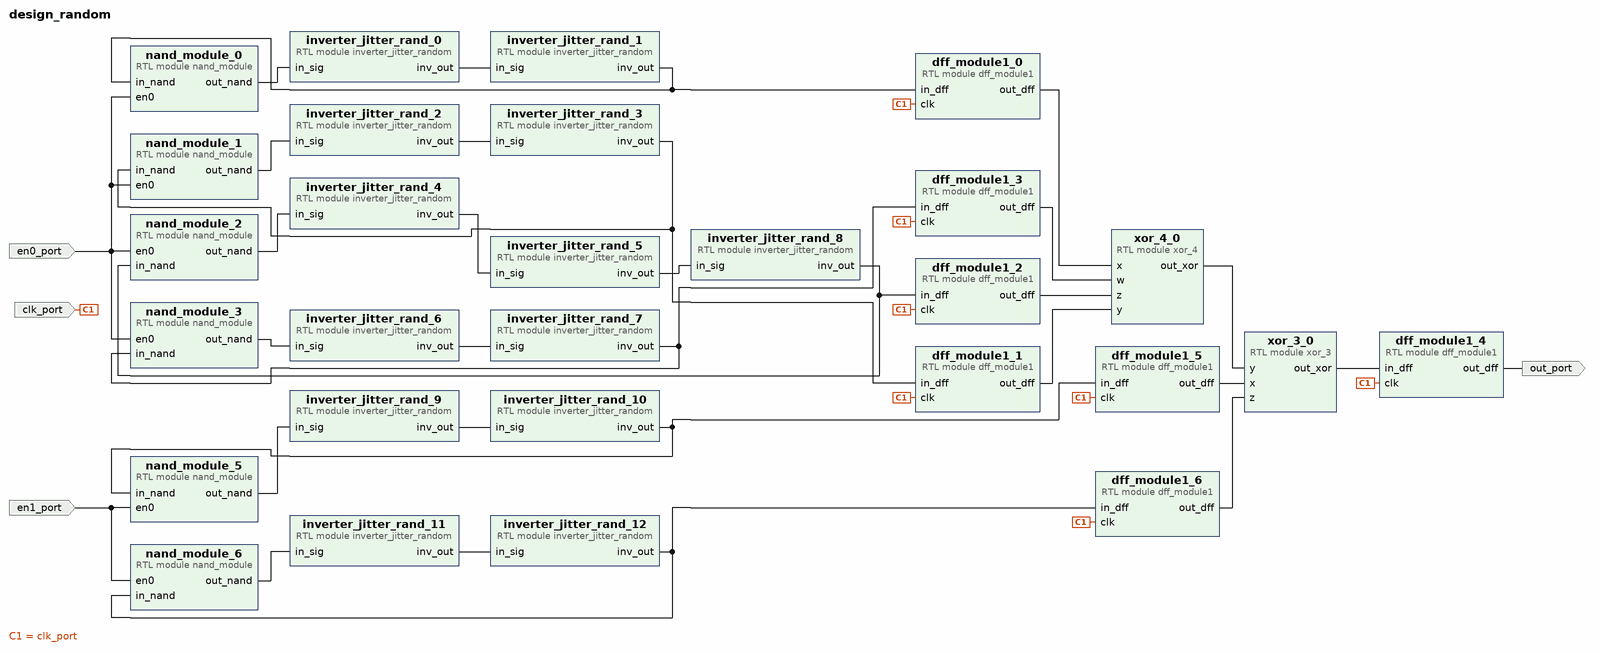
[diagram p0: block diagram of the top level]
# Vivado block design design_random, xc7a100tcsg324-1, Vivado 2024.2
create_bd_design design_random

create_bd_port -dir I en0_port
create_bd_port -dir I clk_port
create_bd_port -dir I en1_port
create_bd_port -dir O out_port

create_bd_cell -type module -reference nand_module nand_module_0
create_bd_cell -type module -reference nand_module nand_module_1
create_bd_cell -type module -reference nand_module nand_module_2
create_bd_cell -type module -reference nand_module nand_module_3
create_bd_cell -type module -reference xor_4 xor_4_0
create_bd_cell -type module -reference nand_module nand_module_5
create_bd_cell -type module -reference nand_module nand_module_6
create_bd_cell -type module -reference xor_3 xor_3_0
create_bd_cell -type module -reference inverter_jitter_random inverter_jitter_rand_0
create_bd_cell -type module -reference inverter_jitter_random inverter_jitter_rand_1
create_bd_cell -type module -reference inverter_jitter_random inverter_jitter_rand_2
create_bd_cell -type module -reference inverter_jitter_random inverter_jitter_rand_3
create_bd_cell -type module -reference inverter_jitter_random inverter_jitter_rand_4
create_bd_cell -type module -reference inverter_jitter_random inverter_jitter_rand_5
create_bd_cell -type module -reference inverter_jitter_random inverter_jitter_rand_6
create_bd_cell -type module -reference inverter_jitter_random inverter_jitter_rand_7
create_bd_cell -type module -reference inverter_jitter_random inverter_jitter_rand_8
create_bd_cell -type module -reference inverter_jitter_random inverter_jitter_rand_9
create_bd_cell -type module -reference inverter_jitter_random inverter_jitter_rand_10
create_bd_cell -type module -reference inverter_jitter_random inverter_jitter_rand_11
create_bd_cell -type module -reference inverter_jitter_random inverter_jitter_rand_12
create_bd_cell -type module -reference dff_module1 dff_module1_0
create_bd_cell -type module -reference dff_module1 dff_module1_1
create_bd_cell -type module -reference dff_module1 dff_module1_2
create_bd_cell -type module -reference dff_module1 dff_module1_3
create_bd_cell -type module -reference dff_module1 dff_module1_4
create_bd_cell -type module -reference dff_module1 dff_module1_5
create_bd_cell -type module -reference dff_module1 dff_module1_6

# ---- connections ----

connect_bd_net [get_bd_ports clk_port] \
  [get_bd_pins dff_module1_0/clk] [get_bd_pins dff_module1_1/clk] [get_bd_pins dff_module1_2/clk] \
  [get_bd_pins dff_module1_3/clk] [get_bd_pins dff_module1_4/clk] [get_bd_pins dff_module1_5/clk] \
  [get_bd_pins dff_module1_6/clk]
connect_bd_net [get_bd_pins dff_module1_0/out_dff] [get_bd_pins xor_4_0/x]
connect_bd_net [get_bd_pins dff_module1_1/out_dff] [get_bd_pins xor_4_0/y]
connect_bd_net [get_bd_pins dff_module1_2/out_dff] [get_bd_pins xor_4_0/z]
connect_bd_net [get_bd_pins dff_module1_3/out_dff] [get_bd_pins xor_4_0/w]
connect_bd_net [get_bd_pins dff_module1_4/out_dff] [get_bd_ports out_port]
connect_bd_net [get_bd_pins dff_module1_5/out_dff] [get_bd_pins xor_3_0/x]
connect_bd_net [get_bd_pins dff_module1_6/out_dff] [get_bd_pins xor_3_0/z]
connect_bd_net [get_bd_ports en0_port] \
  [get_bd_pins nand_module_0/en0] [get_bd_pins nand_module_1/en0] [get_bd_pins nand_module_2/en0] \
  [get_bd_pins nand_module_3/en0]
connect_bd_net [get_bd_ports en1_port] [get_bd_pins nand_module_5/en0] [get_bd_pins nand_module_6/en0]
connect_bd_net -net inverter_jitter_10_inv_out [get_bd_pins inverter_jitter_rand_12/inv_out] \
  [get_bd_pins nand_module_6/in_nand] [get_bd_pins dff_module1_6/in_dff]
connect_bd_net -net inverter_jitter_11_inv_out [get_bd_pins inverter_jitter_rand_10/inv_out] \
  [get_bd_pins nand_module_5/in_nand] [get_bd_pins dff_module1_5/in_dff]
connect_bd_net -net inverter_jitter_2_inv_out [get_bd_pins inverter_jitter_rand_1/inv_out] \
  [get_bd_pins nand_module_0/in_nand] [get_bd_pins dff_module1_0/in_dff]
connect_bd_net -net inverter_jitter_7_inv_out [get_bd_pins inverter_jitter_rand_3/inv_out] \
  [get_bd_pins nand_module_1/in_nand] [get_bd_pins dff_module1_1/in_dff]
connect_bd_net [get_bd_pins inverter_jitter_rand_0/inv_out] [get_bd_pins inverter_jitter_rand_1/in_sig]
connect_bd_net [get_bd_pins inverter_jitter_rand_11/inv_out] [get_bd_pins inverter_jitter_rand_12/in_sig]
connect_bd_net [get_bd_pins inverter_jitter_rand_2/inv_out] [get_bd_pins inverter_jitter_rand_3/in_sig]
connect_bd_net [get_bd_pins inverter_jitter_rand_4/inv_out] [get_bd_pins inverter_jitter_rand_5/in_sig]
connect_bd_net [get_bd_pins inverter_jitter_rand_5/inv_out] [get_bd_pins inverter_jitter_rand_8/in_sig]
connect_bd_net [get_bd_pins inverter_jitter_rand_6/inv_out] [get_bd_pins inverter_jitter_rand_7/in_sig]
connect_bd_net [get_bd_pins inverter_jitter_rand_7/inv_out] [get_bd_pins nand_module_3/in_nand] [get_bd_pins dff_module1_3/in_dff]
connect_bd_net [get_bd_pins inverter_jitter_rand_8/inv_out] [get_bd_pins nand_module_2/in_nand] [get_bd_pins dff_module1_2/in_dff]
connect_bd_net [get_bd_pins inverter_jitter_rand_9/inv_out] [get_bd_pins inverter_jitter_rand_10/in_sig]
connect_bd_net [get_bd_pins nand_module_0/out_nand] [get_bd_pins inverter_jitter_rand_0/in_sig]
connect_bd_net [get_bd_pins nand_module_1/out_nand] [get_bd_pins inverter_jitter_rand_2/in_sig]
connect_bd_net [get_bd_pins nand_module_2/out_nand] [get_bd_pins inverter_jitter_rand_4/in_sig]
connect_bd_net [get_bd_pins nand_module_3/out_nand] [get_bd_pins inverter_jitter_rand_6/in_sig]
connect_bd_net [get_bd_pins nand_module_5/out_nand] [get_bd_pins inverter_jitter_rand_9/in_sig]
connect_bd_net [get_bd_pins nand_module_6/out_nand] [get_bd_pins inverter_jitter_rand_11/in_sig]
connect_bd_net [get_bd_pins xor_3_0/out_xor] [get_bd_pins dff_module1_4/in_dff]
connect_bd_net -net xor_4_0_out [get_bd_pins xor_4_0/out_xor] [get_bd_pins xor_3_0/y]

validate_bd_design
save_bd_design
